# EAGLE design control_board (EAGLE 9.6.2)
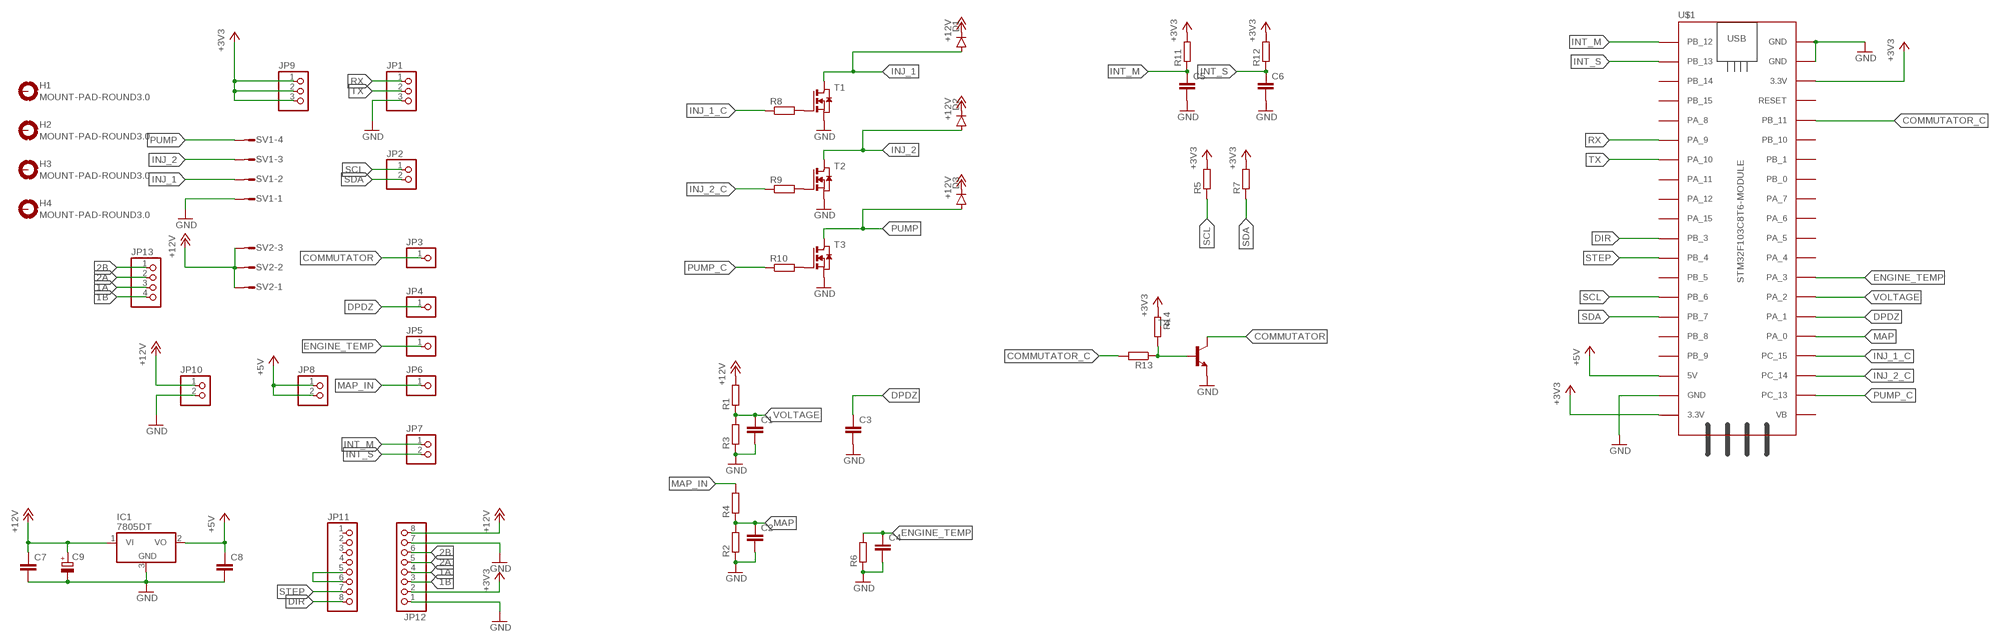
[diagram p0: schematic, sheet 1]

## Parts
C1  C-EUC1206  [C1206]
C2  C-EUC1206  [C1206]
C3  C-EUC1206  [C1206]
C4  C-EUC1206  [C1206]
C5  C-EUC1206  [C1206]
C6  C-EUC1206  [C1206]
C7  C-EUC1206  [C1206]
C8  C-EUC1206  [C1206]
C9  CPOL-EU140CLH-0810  [140CLH-0810]
D1  DIODE-SMB  [SMB]
D2  DIODE-SMB  [SMB]
D3  DIODE-SMB  [SMB]
H1  MOUNT-PAD-ROUND3.0  [3,0-PAD]
H2  MOUNT-PAD-ROUND3.0  [3,0-PAD]
H3  MOUNT-PAD-ROUND3.0  [3,0-PAD]
H4  MOUNT-PAD-ROUND3.0  [3,0-PAD]
IC1  7805DT  [TO252]
JP1  PINHD-1X3  [1X03]
JP2  PINHD-1X2  [1X02]
JP3  PINHD-1X1  [1X01]
JP4  PINHD-1X1  [1X01]
JP5  PINHD-1X1  [1X01]
JP6  PINHD-1X1  [1X01]
JP7  PINHD-1X2  [1X02]
JP8  PINHD-1X2  [1X02]
JP9  PINHD-1X3  [1X03]
JP10  PINHD-1X2  [1X02]
JP11  PINHD-1X8  [1X08]
JP12  PINHD-1X8  [1X08]
JP13  PINHD-1X4  [1X04]
R1  R-EU_R1206  [R1206]
R2  R-EU_R1206  [R1206]
R3  R-EU_R1206  [R1206]
R4  R-EU_R1206  [R1206]
R5  R-EU_R1206  [R1206]
R6  R-EU_R1206  [R1206]
R7  R-EU_R1206  [R1206]
R8  R-EU_R0805  [R0805]
R9  R-EU_R0805  [R0805]
R10  R-EU_R0805  [R0805]
R11  R-EU_R1206  [R1206]
R12  R-EU_R1206  [R1206]
R13  R-EU_R1206  [R1206]
R14  R-EU_R1206  [R1206]
SV1  MT6-4  [MT6-4]
SV2  MT6-3  [MT6-3]
T1  NMOSSOT223  [SOT223]
T2  NMOSSOT223  [SOT223]
T3  NMOSSOT223  [SOT223]
T4  BCX54-NPN-SOT89-BCE  [SOT89-BCE]
U$1  STM32F103C8T6-MODULE  [STM32F103C8T6-MODULE]

## Nets
1A: JP12.4 JP13.3
1B: JP12.3 JP13.4
2A: JP12.5 JP13.2
2B: JP12.6 JP13.1
+3V3: JP9.1 JP9.2 JP9.3 JP12.2 R5.2 R7.2 R11.2 R12.2 R14.1 U$1.3.3V_1(3.3V) U$1.3.3V_2(3.3V)
+5V: C8.1 IC1.2(VO) JP8.1 JP8.2 U$1.5V
+12V: C7.1 C9.+ D1.C D2.C D3.C IC1.1(VI) JP10.1 JP12.8 R1.2 SV2.1 SV2.2 SV2.3
COMMUTATOR: JP3.1 T4.C
COMMUTATOR_C: R13.2 U$1.PB_11
DIR: JP11.8 U$1.PB_3
DPDZ: C3.1 JP4.1 U$1.PA_1
ENGINE_TEMP: C4.1 JP5.1 R6.2 U$1.PA_3
GND: C1.2 C2.2 C3.2 C4.2 C5.2 C6.2 C7.2 C8.2 C9.- IC1.3(GND) JP1.3 JP10.2 JP12.1 JP12.7 R2.1 R3.1 R6.1 SV1.1 T1.3(S) T2.3(S) T3.3(S) T4.E U$1.GND_1(GND) U$1.GND_2(GND) U$1.GND_3(GND)
INJ_1: D1.A SV1.2 T1.2(D) T1.4(D)
INJ_1_C: R8.1 U$1.PC_15
INJ_2: D2.A SV1.3 T2.2(D) T2.4(D)
INJ_2_C: R9.1 U$1.PC_14
INT_M: C5.1 JP7.1 R11.1 U$1.PB_12
INT_S: C6.1 JP7.2 R12.1 U$1.PB_13
MAP: C2.1 R2.2 R4.1 U$1.PA_0
MAP_IN: JP6.1 R4.2
N$1: JP11.5 JP11.6
N$2: R13.1 R14.2 T4.B
N$4: R8.2 T1.1(G)
N$5: R9.2 T2.1(G)
N$6: R10.2 T3.1(G)
PUMP: D3.A SV1.4 T3.2(D) T3.4(D)
PUMP_C: R10.1 U$1.PC_13
RX: JP1.1 U$1.PA_9
SCL: JP2.1 R5.1 U$1.PB_6
SDA: JP2.2 R7.1 U$1.PB_7
STEP: JP11.7 U$1.PB_4
TX: JP1.2 U$1.PA_10
VOLTAGE: C1.1 R1.1 R3.2 U$1.PA_2
Unconnected: H1.B3,0(MOUNT) H2.B3,0(MOUNT) H3.B3,0(MOUNT) H4.B3,0(MOUNT) JP11.1 JP11.2 JP11.3 JP11.4 U$1.PA_4 U$1.PA_5 U$1.PA_6 U$1.PA_7 U$1.PA_8 U$1.PA_11 U$1.PA_12 U$1.PA_15 U$1.PB_0 U$1.PB_1 U$1.PB_5 U$1.PB_8 U$1.PB_9 U$1.PB_10 U$1.PB_14 U$1.PB_15 U$1.RESET U$1.VB

## Library data of the parts
C1-C8 = rcl:C-EU: CAPACITOR, European symbol; SPICEPREFIX: C
C9 = rcl:CPOL-EU: POLARIZED CAPACITOR, European symbol; SPICEPREFIX: C
D1-D3 = diode:DIODE-: DIODE
H1-H4 = holes:MOUNT-PAD-ROUND: MOUNTING PAD, round
IC1 = linear:78*: Positive VOLTAGE REGULATOR Source: http://cache.national.com/ds/LM/LM78L05.pdf http://www.fairchildsemi.com/ds/LM/LM7805.pdf
JP1 JP9 = pinhead:PINHD-1X3: PIN HEADER
JP2 JP7 JP8 JP10 = pinhead:PINHD-1X2: PIN HEADER
JP3-JP6 = pinhead:PINHD-1X1: PIN HEADER
JP11 JP12 = pinhead:PINHD-1X8: PIN HEADER
JP13 = pinhead:PINHD-1X4: PIN HEADER
R1-R14 = rcl:R-EU_: RESISTOR, European symbol; SPICEPREFIX: R
SV1 = con-amp-mt6:MT6-4: AMP MT6 CONNECTOR; OC_FARNELL: unknown; OC_NEWARK: unknown
SV2 = con-amp-mt6:MT6-3: AMP MT6 CONNECTOR; OC_FARNELL: unknown; OC_NEWARK: unknown
T1-T3 = zetex:NMOSSOT223: MOS FET; OC_FARNELL: unknown; OC_NEWARK: unknown
T4 = transistor:*-NPN-: NPN Transistror BF959 corrected 2008.03.06
U$1 = stm32f103c8t6_module:STM32F103C8T6-MODULE: STM32F103C8T6 module with ARM Cortex-3, 20kB SRAM, 64kB Flash, 72MHz

## Board
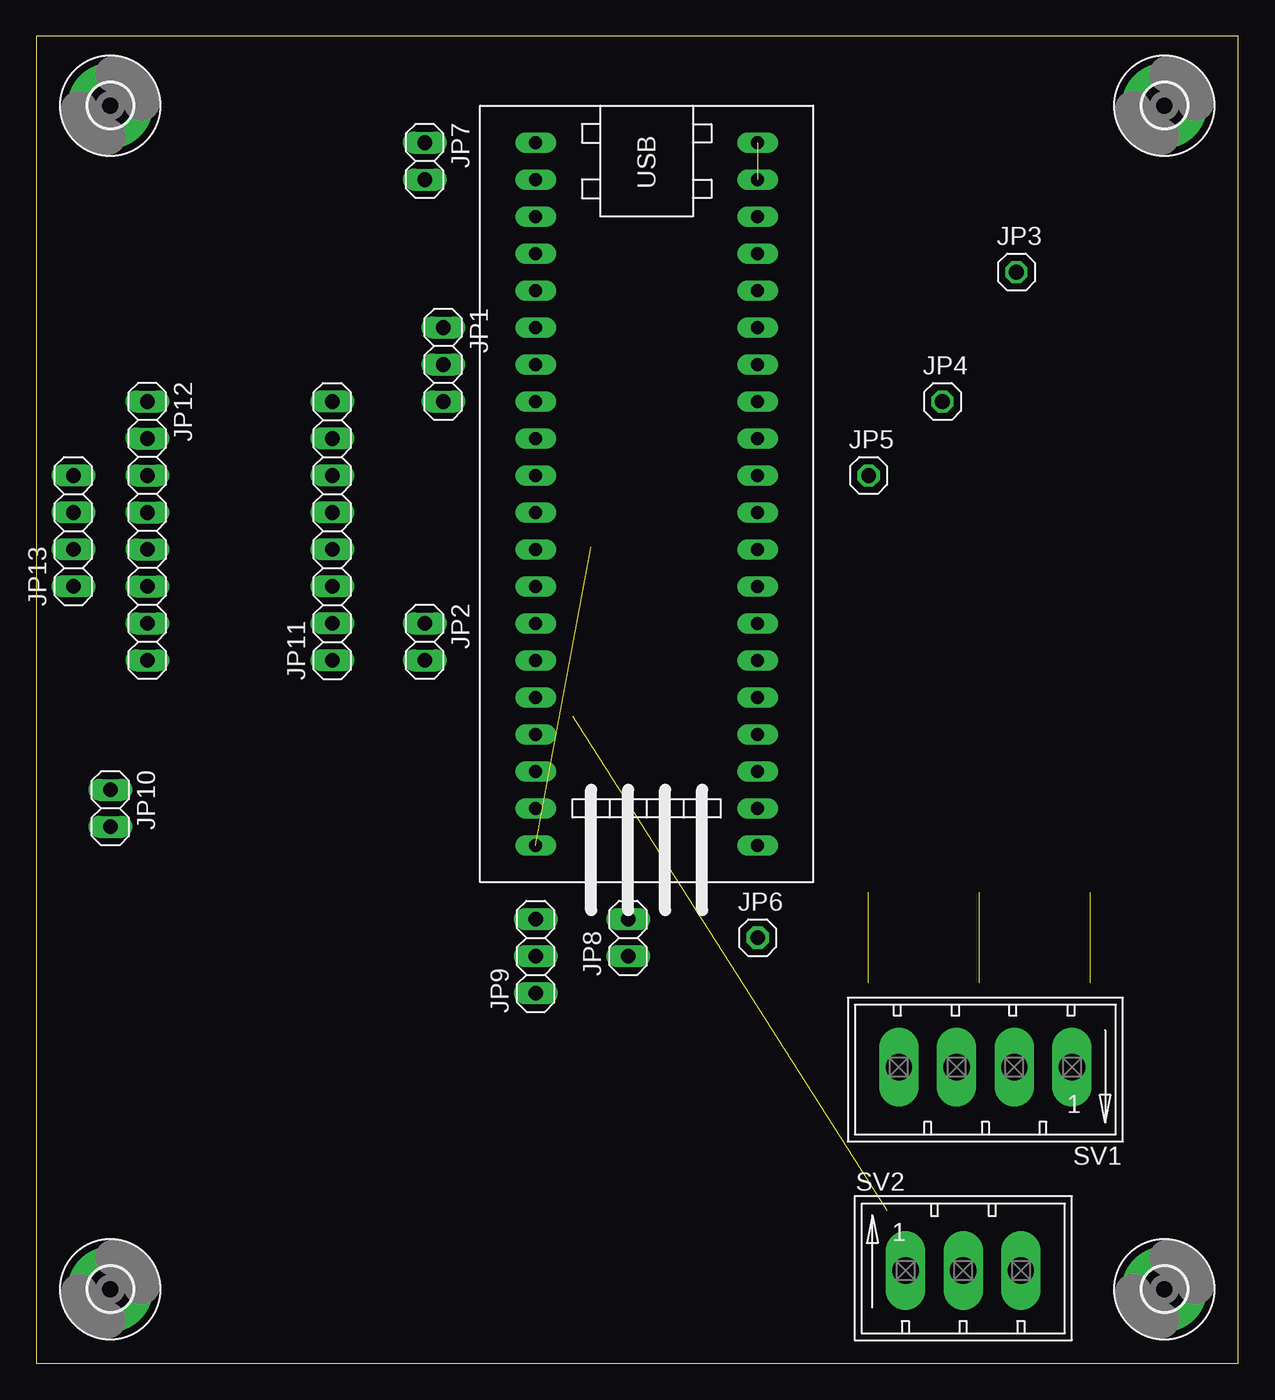
[diagram p1: board, top side]
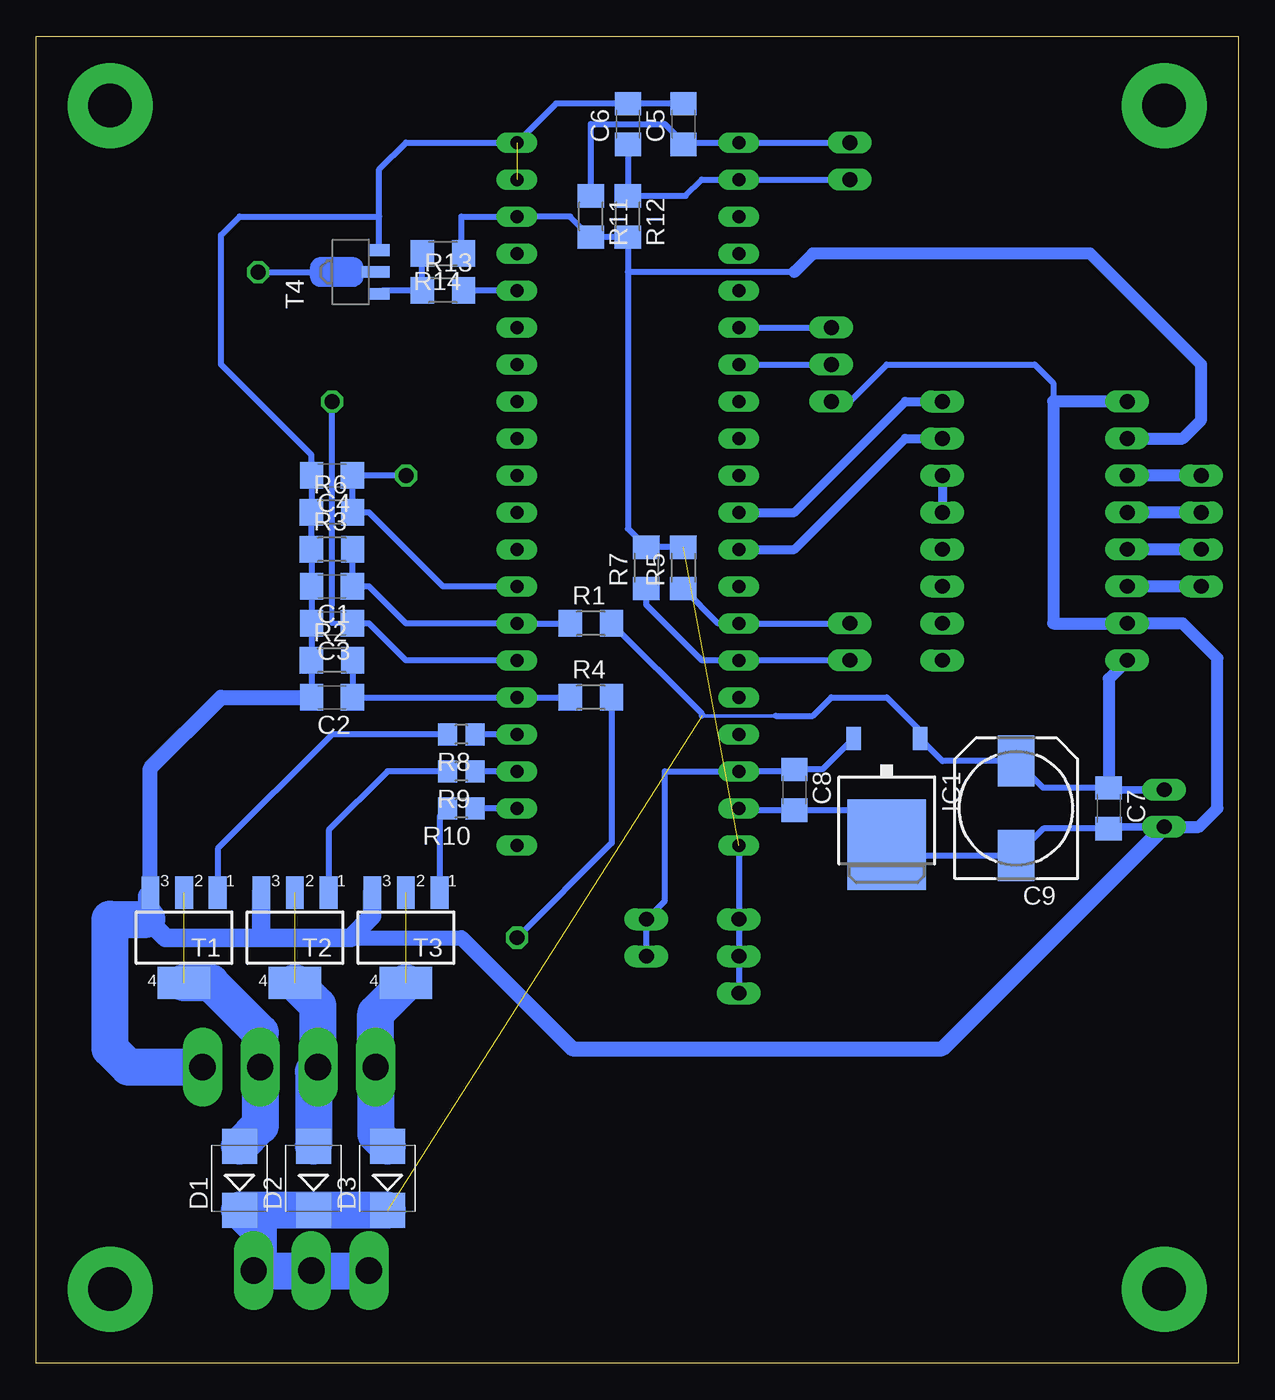
[diagram p2: board, bottom side, seen from below]

Size 82.53 x 91.11 mm. Coordinates in mm from the lower left corner, seen from the top.
Outline: 0,0 82.53,0 82.53,91.11 0,91.11 0,0
Copper layers (1*16): Top 0.035mm / dielectric 1.5mm / Bottom 0.035mm
Design rules "default": minimum track width 6mil, minimum drill 0.35mm, track to track 6mil, track to pad 6mil, pad to pad 6mil, via to via 6mil, smd to smd 6mil, copper to edge 40mil, drill to drill 6mil, minimum pad ring 10mil, minimum via ring 8mil, stop-mask expansion 4mil, vias tented up to drill 0mil, thermal gap 10mil

### Footprints (pad centres in the part's own frame; a part is rotated, then mirrored left to right if it is on the bottom)
C1206 = smd 1.6 x 1.8: 1 -1.4,0; 2 1.4,0
140CLH-0810 = smd 3.5 x 2.5: + 3.25,0; - -3.25,0
SMB = smd 2.4 x 2.4: A 2.2,0; C -2.2,0
3,0-PAD = drill 3 pad 5.842: B3,0 0,0
TO252 = smd 1 x 1.6: 1 -2.28,-4.8; 2 2.28,-4.8 | smd 5.4 x 6.2: 3 0,2.5
1X03 = drill 1.016 long: 1 -2.54,0; 2 0,0; 3 2.54,0
1X02 = drill 1.016 long: 1 -1.27,0; 2 1.27,0
1X01 = drill 1.016 octagon: 1 0,0
1X08 = drill 1.016 long: 1 -8.89,0; 2 -6.35,0; 3 -3.81,0; 4 -1.27,0; 5 1.27,0; 6 3.81,0; 7 6.35,0; 8 8.89,0
1X04 = drill 1.016 long: 1 -3.81,0; 2 -1.27,0; 3 1.27,0; 4 3.81,0
R1206 = smd 1.6 x 1.803: 1 -1.422,0; 2 1.422,0
R0805 = smd 1.3 x 1.5: 1 -0.95,0; 2 0.95,0
MT6-4 = drill 1.803 long: 1 2.54,0; 2 6.502,0; 3 10.465,0; 4 14.427,0
MT6-3 = drill 1.803 long: 1 2.54,0; 2 6.502,0; 3 10.465,0
SOT223 = smd 1.219 x 2.235: 1 -2.311,-3.099; 2 0,-3.099; 3 2.311,-3.099 | smd 3.6 x 2.2: 4 0,3.099
SOT89-BCE = smd 0.8 x 1.4: B -1.499,-1.981; E 1.499,-1.981 | smd 0.8 x 1.9: C 0,-1.727
STM32F103C8T6-MODULE = drill 0.9 long: 3.3V_1 25.4,-7.62; 3.3V_2 -17.78,7.62; 5V 20.32,-7.62; GND_1 22.86,-7.62; GND_2 -20.32,7.62; GND_3 -22.86,7.62; PA_0 15.24,7.62; PA_1 12.7,7.62; PA_2 10.16,7.62; PA_3 7.62,7.62; PA_4 5.08,7.62; PA_5 2.54,7.62; PA_6 0,7.62; PA_7 -2.54,7.62; PA_8 -12.7,-7.62; PA_9 -10.16,-7.62; PA_10 -7.62,-7.62; PA_11 -5.08,-7.62; PA_12 -2.54,-7.62; PA_15 0,-7.62; PB_0 -5.08,7.62; PB_1 -7.62,7.62; PB_3 2.54,-7.62; PB_4 5.08,-7.62; PB_5 7.62,-7.62; PB_6 10.16,-7.62; PB_7 12.7,-7.62; PB_8 15.24,-7.62; PB_9 17.78,-7.62; PB_10 -10.16,7.62; PB_11 -12.7,7.62; PB_12 -22.86,-7.62; PB_13 -20.32,-7.62; PB_14 -17.78,-7.62; PB_15 -15.24,-7.62; PC_13 22.86,7.62; PC_14 20.32,7.62; PC_15 17.78,7.62; RESET -15.24,7.62; VB 25.4,7.62

### Placement (x,y rotation side)
C1  62.23,53.34 180 bottom
C2  62.23,45.72 180 bottom
C3  62.23,50.8 180 bottom
C4  62.23,60.96 180 bottom
C5  38.1,85.09 90 bottom
C6  41.91,85.09 90 bottom
C7  8.89,38.1 270 bottom
C8  30.48,39.37 270 bottom
C9  15.24,38.1 90 bottom
D1  68.58,12.7 90 bottom
D2  63.5,12.7 90 bottom
D3  58.42,12.7 90 bottom
H1  5.08,5.08 0 top
H2  5.08,86.36 0 top
H3  77.47,5.08 0 top
H4  77.47,86.36 0 top
IC1  24.13,38.1 180 bottom
JP1  27.94,68.58 270 top
JP2  26.67,49.53 270 top
JP3  67.31,74.93 0 top
JP4  62.23,66.04 0 top
JP5  57.15,60.96 0 top
JP6  49.53,29.21 0 top
JP7  26.67,82.55 270 top
JP8  40.64,29.21 90 top
JP9  34.29,27.94 90 top
JP10  5.08,38.1 270 top
JP11  20.32,57.15 90 top
JP12  7.62,57.15 270 top
JP13  2.54,57.15 90 top
R1  44.45,50.8 0 bottom
R2  62.23,48.26 0 bottom
R3  62.23,55.88 0 bottom
R4  44.45,45.72 0 bottom
R5  38.1,54.61 90 bottom
R6  62.23,58.42 0 bottom
R7  40.64,54.61 90 bottom
R8  53.34,43.18 180 bottom
R9  53.34,40.64 180 bottom
R10  53.34,38.1 180 bottom
R11  44.45,78.74 270 bottom
R12  41.91,78.74 270 bottom
R13  54.61,73.66 0 bottom
R14  54.61,76.2 180 bottom
SV1  73.66,20.32 180 top
SV2  57.15,6.35 0 top
T1  72.39,29.21 180 bottom
T2  64.77,29.21 180 bottom
T3  57.15,29.21 180 bottom
T4  60.96,74.93 90 bottom
U$1  41.91,60.96 270 top

### Tracks (layer width: path | path; a pad name or v marks a point on that pad's centre or on a via)
1A
  Bottom 0.813: JP13.3 JP12.4
1B
  Bottom 0.813: JP13.4 JP12.3
2A
  Bottom 0.813: JP13.2 JP12.5
2B
  Bottom 0.813: JP13.1 JP12.6
+3V3  (1 unrouted)
  Bottom 0.406: R14.1 53.34,76.35 53.34,78.74 U$1.3.3V_2 45.87,78.74 R11.2 R12.2 41.91,74.93 | R5.2 R7.2 41.91,57.3 41.91,74.93 | U$1.3.3V_1 JP9.3 JP9.2 JP9.1 | 30.48,74.93 41.91,74.93
  Bottom 0.813: JP12.2 3.81,63.5 2.54,64.77 2.54,68.58 10.16,76.2 29.21,76.2 30.48,74.93
+5V
  Bottom 0.406: IC1.2 28.54,40.77 C8.1 30.61,40.64 U$1.5V 39.37,40.64 39.37,31.75 JP8.2 JP8.1
+12V  (1 unrouted)
  Bottom 0.254: 36.83,44.6 36.68,44.45 31.75,44.45
  Bottom 0.406: C7.1 13.39,39.5 C9.+ 20.3,41.35 IC1.1 21.85,43.44 24.13,45.72 27.94,45.72 29.21,44.45 31.75,44.45 | R1.2 36.83,44.6 36.83,44.45
  Bottom 0.508: C7.1 8.76,39.37 JP10.1
  Bottom 0.813: JP12.8 8.89,46.99 C7.1
  Bottom 2.54: SV2.1 SV2.2 SV2.3 67.31,6.35 67.31,9.23 D1.C D2.C D3.C
COMMUTATOR
  Bottom 0.406: JP3.1 T4.C
COMMUTATOR_C
  Bottom 0.406: U$1.PB_11 R13.2
DIR
  Bottom 0.61: U$1.PB_3 30.48,58.42 22.86,66.04 JP11.8
DPDZ
  Bottom 0.35: C3.1 62.23,50.8 62.23,52.07
  Bottom 0.406: U$1.PA_1 57.15,48.26 59.69,50.8 C3.1 | 62.23,52.07 JP4.1
ENGINE_TEMP
  Bottom 0.406: U$1.PA_3 54.61,53.34 59.69,58.42 R6.2 | 60.96,58.42 R6.2 | R6.2 60.83,58.44 C4.1 JP5.1
GND  (1 unrouted)
  Bottom 0.406: U$1.GND_1 34.16,37.97 C8.2 26.5,37.97 IC1.3 23.38,34.85 C9.- 13.39,36.7 C7.2 | C2.2 63.63,48.24 R2.1 63.63,48.28 C3.2 C1.2 63.63,55.86 R3.1 R6.1 63.63,58.44 C4.2 63.63,62.36 69.85,68.58 69.85,77.47 68.58,78.74 58.98,78.74 | C5.2 C6.2 46.86,86.49 U$1.GND_3 57.15,83.82 58.98,81.99 58.98,78.74 | T4.E 58.98,78.74 | JP1.3 26.67,66.04 24.13,68.58 13.97,68.58 12.7,67.31 12.7,66.04
  Bottom 0.508: C7.2 8.76,36.83 JP10.2
  Bottom 0.813: JP12.1 12.7,66.04 12.7,50.8 JP12.7 3.81,50.8 1.42,48.41 1.42,38.1 2.69,36.83 JP10.2
  Bottom 1.016: T1.3 74.7,40.87 69.85,45.72 C2.2 | JP10.2 20.32,21.59 45.72,21.59 53.34,29.21 60.96,29.21
  Bottom 1.27: T3.3 59.46,30.71 60.96,29.21 67.31,29.21 | T1.3 74.93,32.08 74.93,30.48 73.66,29.21 67.31,29.21 | T2.3 67.08,29.44 67.31,29.21
  Bottom 2.54: SV1.1 76.2,20.32 77.47,21.59 77.47,30.48 74.93,30.48
INJ_1  (1 unrouted)
  Bottom 2.54: D1.A 67.16,16.32 SV1.2 67.16,22.71 70.56,26.11 T1.4
INJ_1_C
  Bottom 0.406: U$1.PC_15 R8.1
INJ_2  (1 unrouted)
  Bottom 2.54: D2.A 63.5,20.02 SV1.3 63.2,24.54 T2.4
INJ_2_C
  Bottom 0.406: U$1.PC_14 R9.1
INT_M
  Bottom 0.406: R11.1 44.45,85.09 39.37,85.09 38.1,83.82 C5.1 37.97,83.82 U$1.PB_12 JP7.1
INT_S
  Bottom 0.406: C6.1 R12.1 37.95,80.16 36.83,81.28 U$1.PB_13 JP7.2
MAP
  Bottom 0.406: R2.2 60.83,48.24 C2.1 U$1.PA_0 R4.1
MAP_IN
  Bottom 0.406: R4.2 43.03,35.71 JP6.1
N$1
  Bottom 0.61: JP11.6 JP11.5
N$2
  Bottom 0.406: R14.2 R13.1 58.75,73.66 T4.B
N$4
  Bottom 0.406: 54.52,43.41 R8.2 62.23,43.18 70.08,35.33 T1.1
N$5
  Bottom 0.406: R9.2 58.42,40.64 62.46,36.6 T2.1
N$6
  Bottom 0.406: R10.2 54.84,37.55 T3.1
PUMP  (1 unrouted)
  Bottom 2.54: D3.A 59.23,15.71 SV1.4 59.23,24.03 T3.4
PUMP_C
  Bottom 0.406: U$1.PC_13 R10.1
RX
  Bottom 0.406: U$1.PA_9 JP1.1
SCL
  Bottom 0.406: R5.1 35.71,50.8 U$1.PB_6 JP2.1
SDA
  Bottom 0.406: R7.1 40.64,52.07 36.83,48.26 U$1.PB_7 JP2.2
STEP
  Bottom 0.61: U$1.PB_4 30.48,55.88 22.86,63.5 JP11.7
TX
  Bottom 0.406: U$1.PA_10 JP1.2
VOLTAGE
  Bottom 0.406: R3.2 60.83,55.86 C1.1 59.69,53.34 57.15,50.8 U$1.PA_2 R1.1